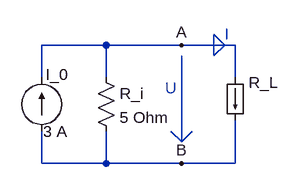
[diagram p0: schematic part01-current-source.asc]
part01-current-source.asc, the LTspice schematic file:
Version 4.1
SHEET 1 880 680
WIRE 144 -144 48 -144
WIRE 256 -144 144 -144
WIRE 336 -144 256 -144
WIRE 48 -96 48 -144
WIRE 144 -96 144 -144
WIRE 336 -96 336 -144
WIRE 48 32 48 -16
WIRE 144 32 144 -16
WIRE 144 32 48 32
WIRE 256 32 144 32
WIRE 336 32 336 -32
WIRE 336 32 256 32
FLAG 256 -144 A
FLAG 256 32 B
SYMBOL load 320 -96 R0
SYMATTR InstName R_L
SYMATTR Value ""
SYMBOL res 128 -112 R0
SYMATTR InstName R_i
SYMATTR Value 5 Ohm
SYMBOL current 48 -16 R180
WINDOW 0 -40 84 Left 2
WINDOW 3 -38 -1 Left 2
SYMATTR InstName I_0
SYMATTR Value 3 A
TEXT 320 -160 Left 2 ;I
TEXT 232 -80 Left 2 ;U
LINE Normal 304 -160 320 -144
LINE Normal 304 -128 320 -144
LINE Normal 304 -160 304 -128
LINE Normal 256 0 256 -128
LINE Normal 240 -16 256 0
LINE Normal 256 0 240 -16
LINE Normal 272 -16 256 0

The netlist it stands for:
* part01-current-source.asc
I§R_L A B
R_i A B 5 Ohm
I_0 B A 3 A
* I
* U
.backanno
.end